# Altium schematic sheet P02_BCS1_JTAG, Clock, LED.SchDoc
size A3; Date: 24.11.2011; CheckedBy: Finke; Author: Mierau; DrawnBy: Mierau; SheetNumber: 2; SheetTotal: 8; Anlage: 78; Beschreibung: Qseven; Kunde: 56; ProjektName: BCS1; ProjektNummer: 88xxx; Ersatz_fuer: 12; ersetzt_durch: 34; LKNummer: 6190202; ID_Nummer: 90
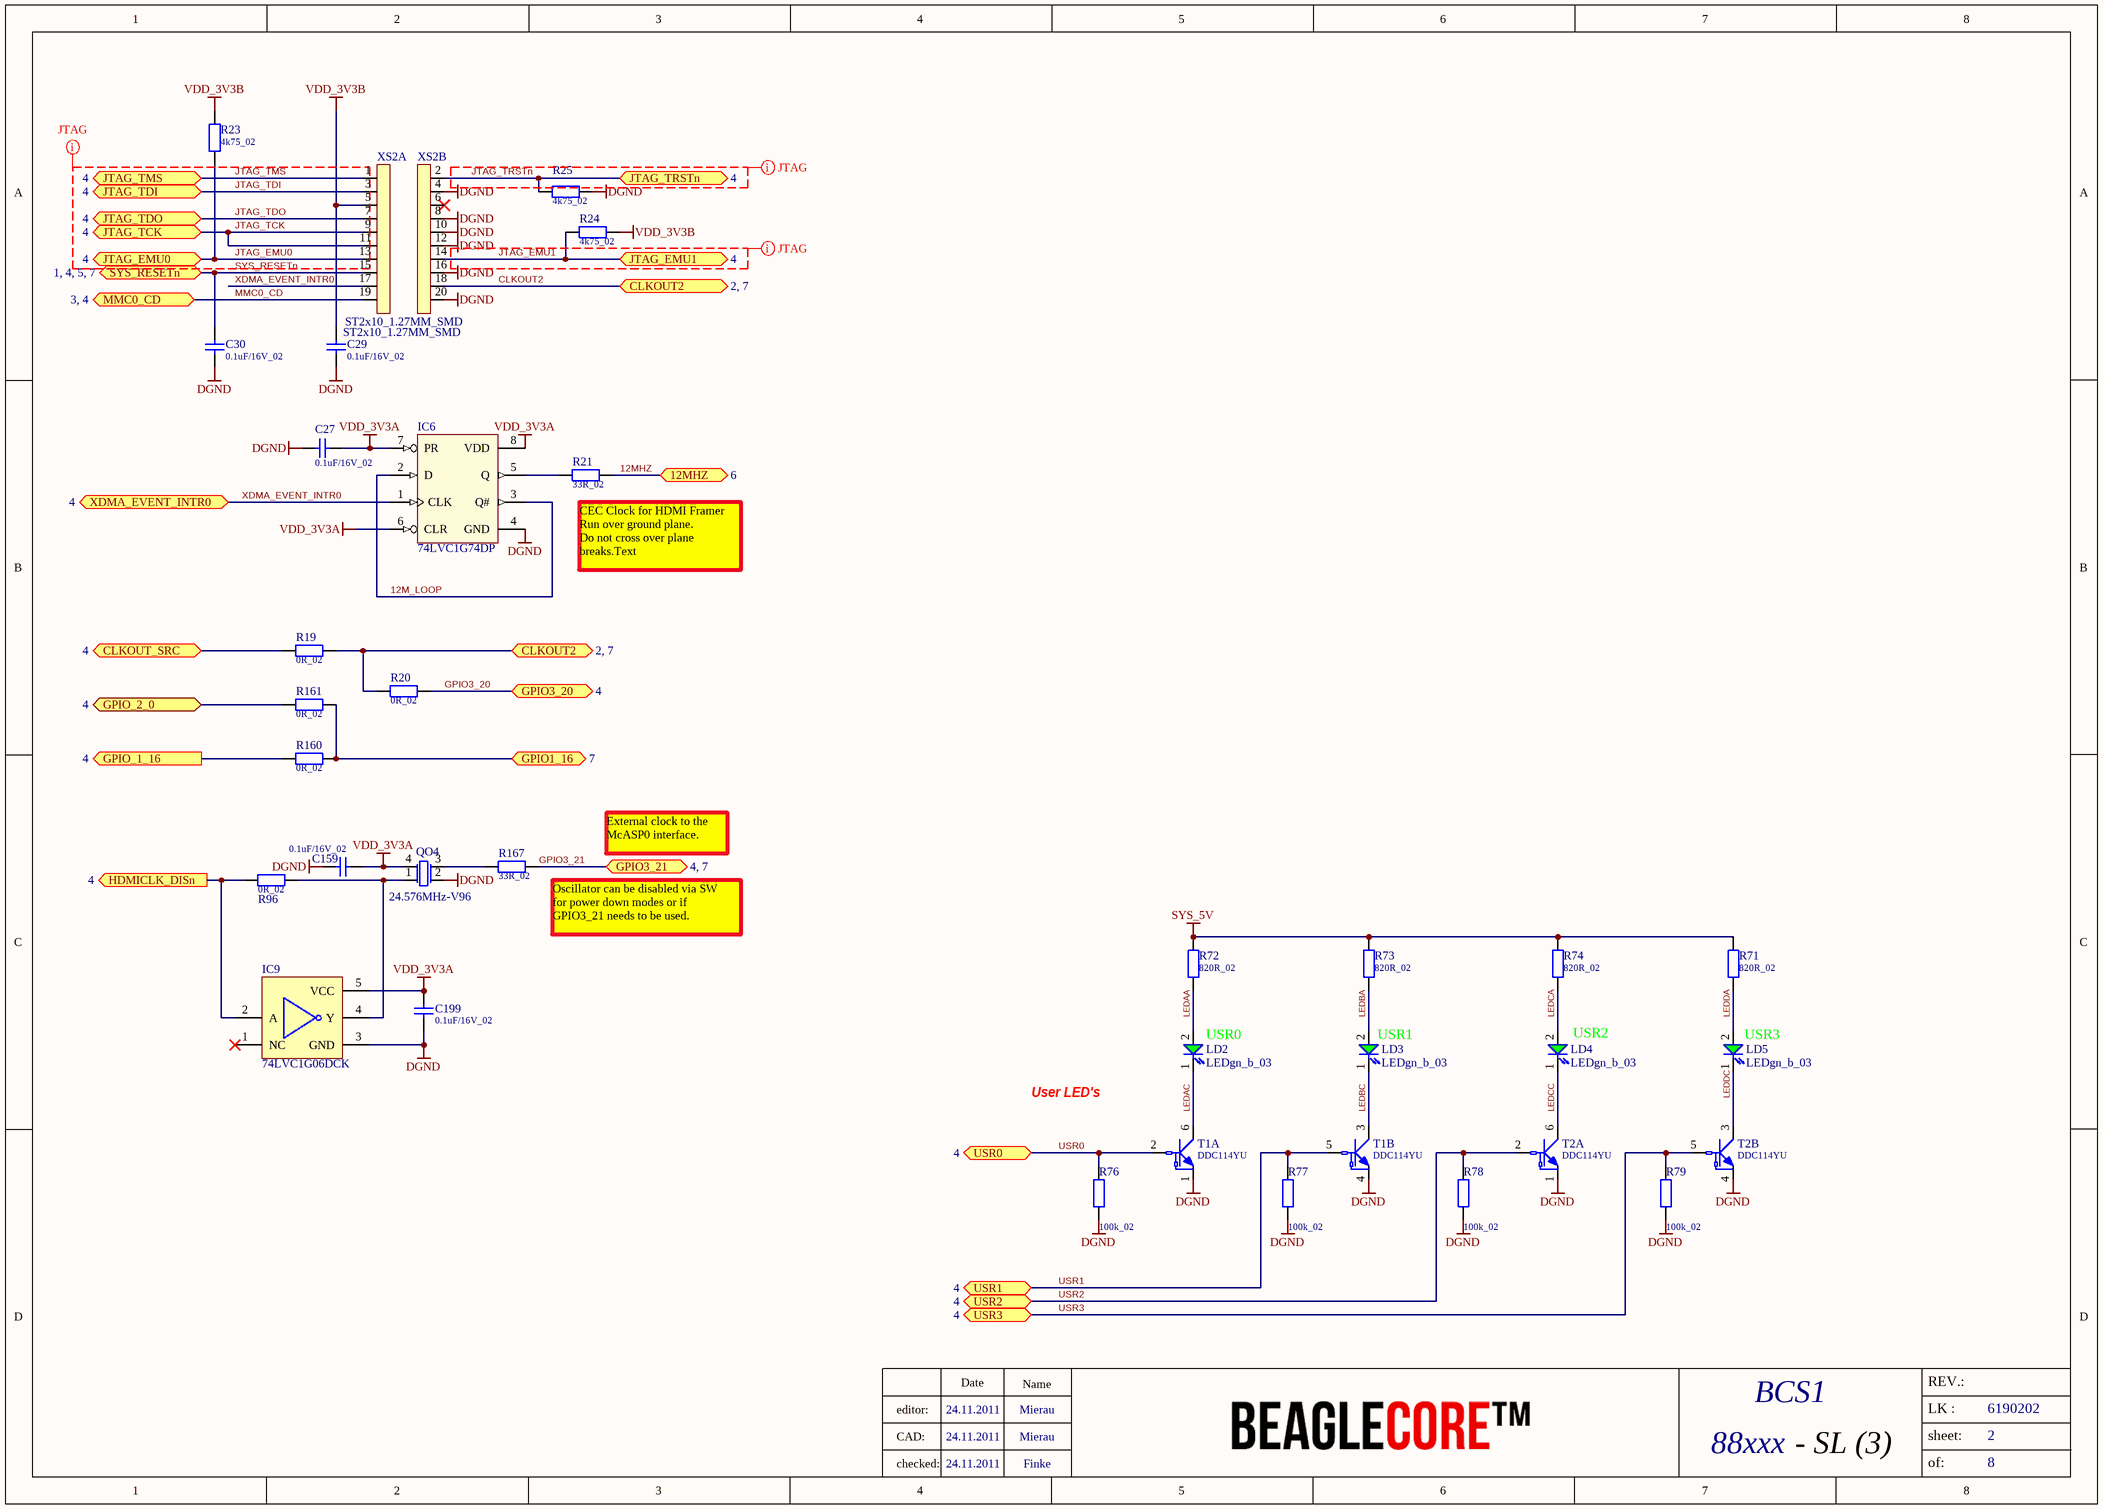
[diagram p0: P02_BCS1_JTAG, Clock, LED.SchDoc]

## Parts
C27  0.1uF/16V_02  [CC1005-0402]
C29  0.1uF/16V_02  [CC1005-0402]
C30  0.1uF/16V_02  [CC1005-0402]
C159  0.1uF/16V_02  [CC1005-0402]
C199  0.1uF/16V_02  [CC1005-0402]
IC6  74LVC1G74DP  [TSSOP8 - 3x3]
IC9  74LVC1G06DCK  [SOT353]
LD2  LEDgn_b_03  [CD1608-0603]
LD3  LEDgn_b_03  [CD1608-0603]
LD4  LEDgn_b_03  [CD1608-0603]
LD5  LEDgn_b_03  [CD1608-0603]
QO4  24.576MHz-V96  [QUARZ KXO-V96]
R19  0R_02  [CR1005-0402]
R20  0R_02  [CR1005-0402]
R21  33R_02  [CR1005-0402]
R23  4k75_02  [CR1005-0402]
R24  4k75_02  [CR1005-0402]
R25  4k75_02  [CR1005-0402]
R71  820R_02  [CR1005-0402]
R72  820R_02  [CR1005-0402]
R73  820R_02  [CR1005-0402]
R74  820R_02  [CR1005-0402]
R76  100k_02  [CR1005-0402]
R77  100k_02  [CR1005-0402]
R78  100k_02  [CR1005-0402]
R79  100k_02  [CR1005-0402]
R96  0R_02  [CR1005-0402]
R160  0R_02  [CR1005-0402]
R161  0R_02  [CR1005-0402]
R167  33R_02  [CR1005-0402]
T1  DDC114YU  [SOT363]  (parts A,B of 2)
T2  DDC114YU  [SOT363]  (parts A,B of 2)
XS2  ST2x10_1.27MM_SMD  [ST2X10SMD-1.27_SAMTEC]  (parts A,B of 2)

## Ports
12MHZ (see 6), CLKOUT2 (see 2, 7), CLKOUT_SRC (bidir, see 4), GPIO1_16 (see 7), GPIO3_20 (see 4), GPIO3_21 (see 4, 7), GPIO_1_16 (out, see 4), GPIO_2_0 (bidir, see 4), HDMICLK_DISn (out, see 4), JTAG_EMU0 (see 4), JTAG_EMU1 (see 4), JTAG_TCK (see 4), JTAG_TDI (see 4), JTAG_TDO (see 4), JTAG_TMS (see 4), JTAG_TRSTn (see 4), MMC0_CD (see 3, 4), SYS_RESETn (see 1, 4, 5, 7), USR0 (see 4), USR1 (see 4), USR2 (see 4), USR3 (see 4), XDMA_EVENT_INTR0 (bidir, see 4)

## Nets
DGND: C27.2 C29.1 C30.1 C159.1 C199.1 IC6.4(GND) IC9.3(GND) QO4.2(GND) R25.2 R76.1 R77.1 R78.1 R79.1 T1.1(EMITTER1) T1.4(EMITTER2) T2.1(EMITTER1) T2.4(EMITTER2) XS2.4 XS2.8 XS2.10 XS2.12 XS2.16 XS2.20
SYS_5V: R71.1 R72.1 R73.1 R74.1
VDD_3V3A: C27.1 C159.2 C199.2 IC6.6(CLR) IC6.7(PR) IC6.8(VDD) IC9.5(VCC) QO4.4(VDD)
VDD_3V3B: C29.2 R23.1 R24.1 XS2.5
12M_LOOP: IC6.2(D) IC6.3(Q#)
12MHZ: R21.2 ; port 12MHZ
CLKOUT2: R19.2 R20.1 XS2.18 ; port CLKOUT2
CLKOUT_SRC: R19.1 ; port CLKOUT_SRC
GPIO1_16: R160.2 R161.2 ; port GPIO1_16
GPIO3_20: R20.2 ; port GPIO3_20
GPIO3_21: R167.2 ; port GPIO3_21
GPIO_1_16: R160.1 ; port GPIO_1_16
GPIO_2_0: R161.1 ; port GPIO_2_0
HDMICLK_DISn: IC9.2(A) R96.1 ; port HDMICLK_DISn
JTAG_EMU0: R23.2 XS2.13 ; port JTAG_EMU0
JTAG_EMU1: R24.2 XS2.14 ; port JTAG_EMU1
JTAG_TCK: XS2.9 XS2.11 ; port JTAG_TCK
JTAG_TDI: XS2.3 ; port JTAG_TDI
JTAG_TDO: XS2.7 ; port JTAG_TDO
JTAG_TMS: XS2.1 ; port JTAG_TMS
JTAG_TRSTn: R25.1 XS2.2 ; port JTAG_TRSTn
LEDAA: LD2.2(A) R72.2
LEDAC: LD2.1(K) T1.6(COLLECTOR1)
LEDBA: LD3.2(A) R73.2
LEDBC: LD3.1(K) T1.3(COLLECTOR2)
LEDCA: LD4.2(A) R74.2
LEDCC: LD4.1(K) T2.6(COLLECTOR1)
LEDDA: LD5.2(A) R71.2
LEDDC: LD5.1(K) T2.3(COLLECTOR2)
MMC0_CD: XS2.19 ; port MMC0_CD
SYS_RESETn: C30.2 XS2.15 ; port SYS_RESETn
USR0: R76.2 T1.2(BASE1) ; port USR0
USR1: R77.2 T1.5(BASE2) ; port USR1
USR2: R78.2 T2.2(BASE1) ; port USR2
USR3: R79.2 T2.5(BASE2) ; port USR3
XDMA_EVENT_INTR0: IC6.1(CLK) XS2.17 ; port XDMA_EVENT_INTR0
NetIC6_5: IC6.5(Q) R21.1
NetIC9_4: IC9.4(Y) QO4.1(EN#) R96.2
NetQO4_3: QO4.3(OUTPUT) R167.1

Not connected (* = marked no-connect by the designer): IC9 1(NC)*; XS2 6*

## Layout directives
net class JTAG: JTAG_EMU0, JTAG_EMU1, JTAG_TCK, JTAG_TDI, JTAG_TDO, JTAG_TMS, JTAG_TRSTn

## Notes on the sheet
- (near R21) CEC Clock for HDMI Framer
  Run over ground plane.
  Do not cross over plane
  breaks.Text
- External clock to the
  McASP0 interface.
- (near R167) Oscillator can be disabled via SW
  for power down modes or if
  GPIO3_21 needs to be used.
- (near LD2) USR0
- (near LD3) USR1
- (near LD4) USR2
- (near LD5) USR3
- User LED's
- Date
- Name
- REV.:
- editor:
- CAD:
- - SL (3)
- sheet:
- LK :
- checked:
- of:

## Library data of the parts
C27 C29 C30 C159 C199 = C0.1uF/16V_02: Capacitor 0402 16V Y5V; Value: 0.1uF/16V_02
IC6 = IC74LVC1G74DP: Dual D-Type Positive-Edge-Triggered Flip-Flop with Set and Reset; Hersteller: NXP; Bestellbezeichnung: 74LVC1G74DP; Value: 74LVC1G74DP
IC9 = IC74LVC1G06DCK: Single Inverter Buffer/Driver With Open-Drain Output; Hersteller: TI; Bestellbezeichnung: 74LVC1G06DCK; Value: 74LVC1G06DCK
LD2-LD5 = LD_LEDgn_bright_03: Leuchtdiode bright grün 0603, RV(5mA)@3V3= 100OHM; Hersteller: Würth Elektronik; Bestellbezeichnung: 150060VS75000; Value: LEDgn_b_03
QO4 = QO24.576MHz_V96: Quarz Oszillator 24.576MHz; KXO-V96; Hersteller: Geyer; Bestellbezeichnung: KXO-V96 24.576MHz; Value: 24.576MHz-V96
R19 R20 R96 R160 R161 = R0R_02: Resistor 0402; Value: 0R_02
R21 R167 = R33R_02: Resistor 0402; Value: 33R_02
R23-R25 = R4k75_02: Resistor 0402; Value: 4k75_02
R71-R74 = R820R_02: Resistor 0402; Value: 820R_02
R76-R79 = R100k_02: Resistor 0402; Value: 100k_02
T1 T2 = TDDC114YU: 2 fach NPN m Widerständen Vceo=40V, Ic=0.1A; Hersteller: Rohm; Bestellbezeichnung: DDC114YU; Value: DDC114YU
XS2 = XST2X10_1.27MM_SMD_SAM: Stiftleiste 20polig, 1.27mm pitch, Samtec; Bestellbezeichnung: FTR-110-03-G-D-06; Hersteller: Samtec; Value: ST2x10_1.27MM_SMD